# Altium project CarClimat.PrjPcb
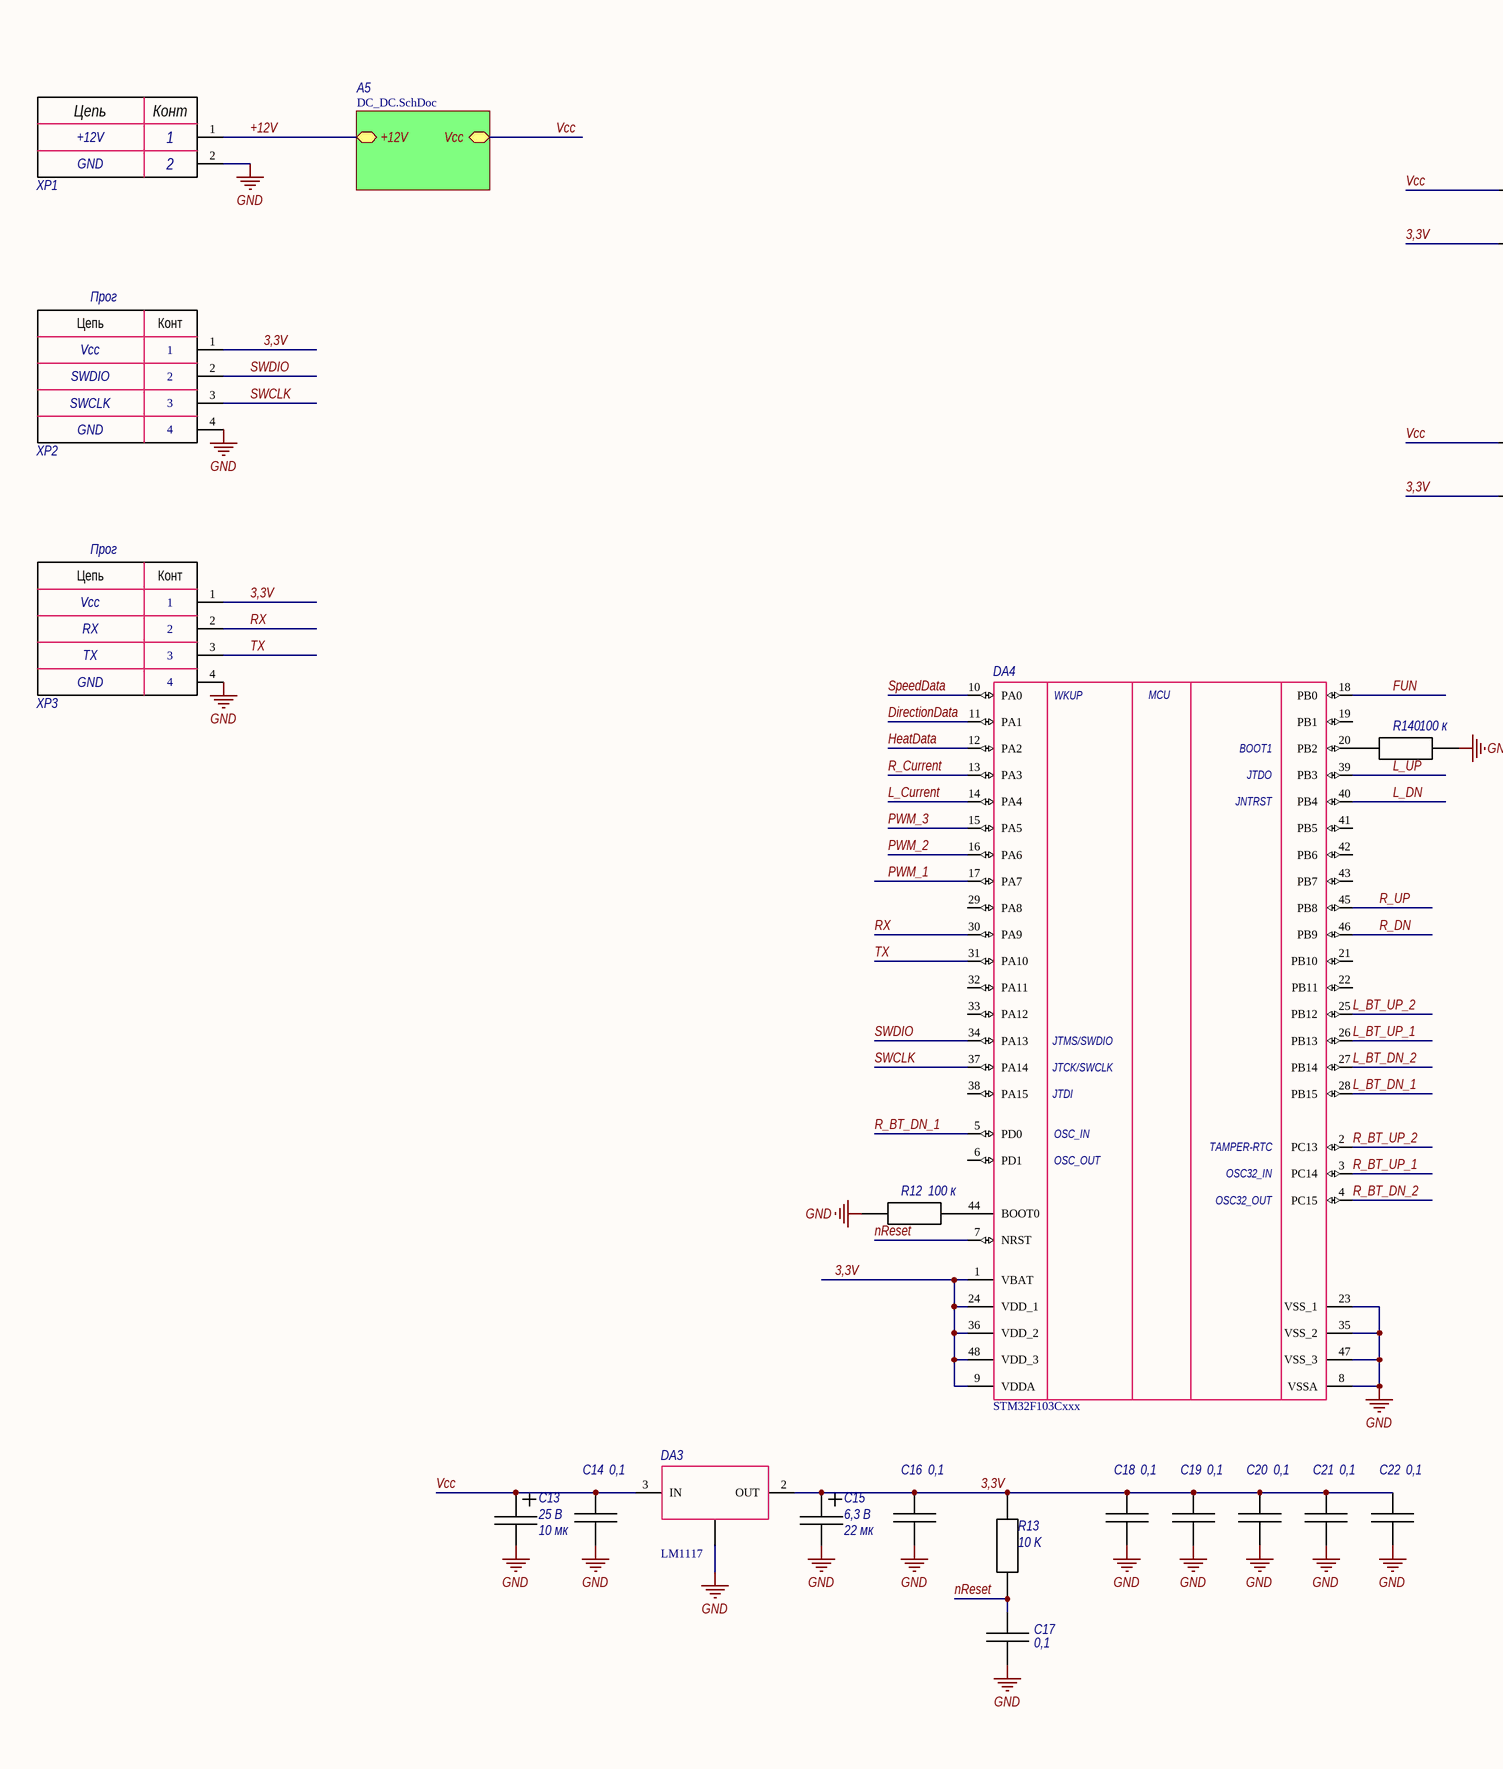
[diagram p0: MCU.SchDoc, left]
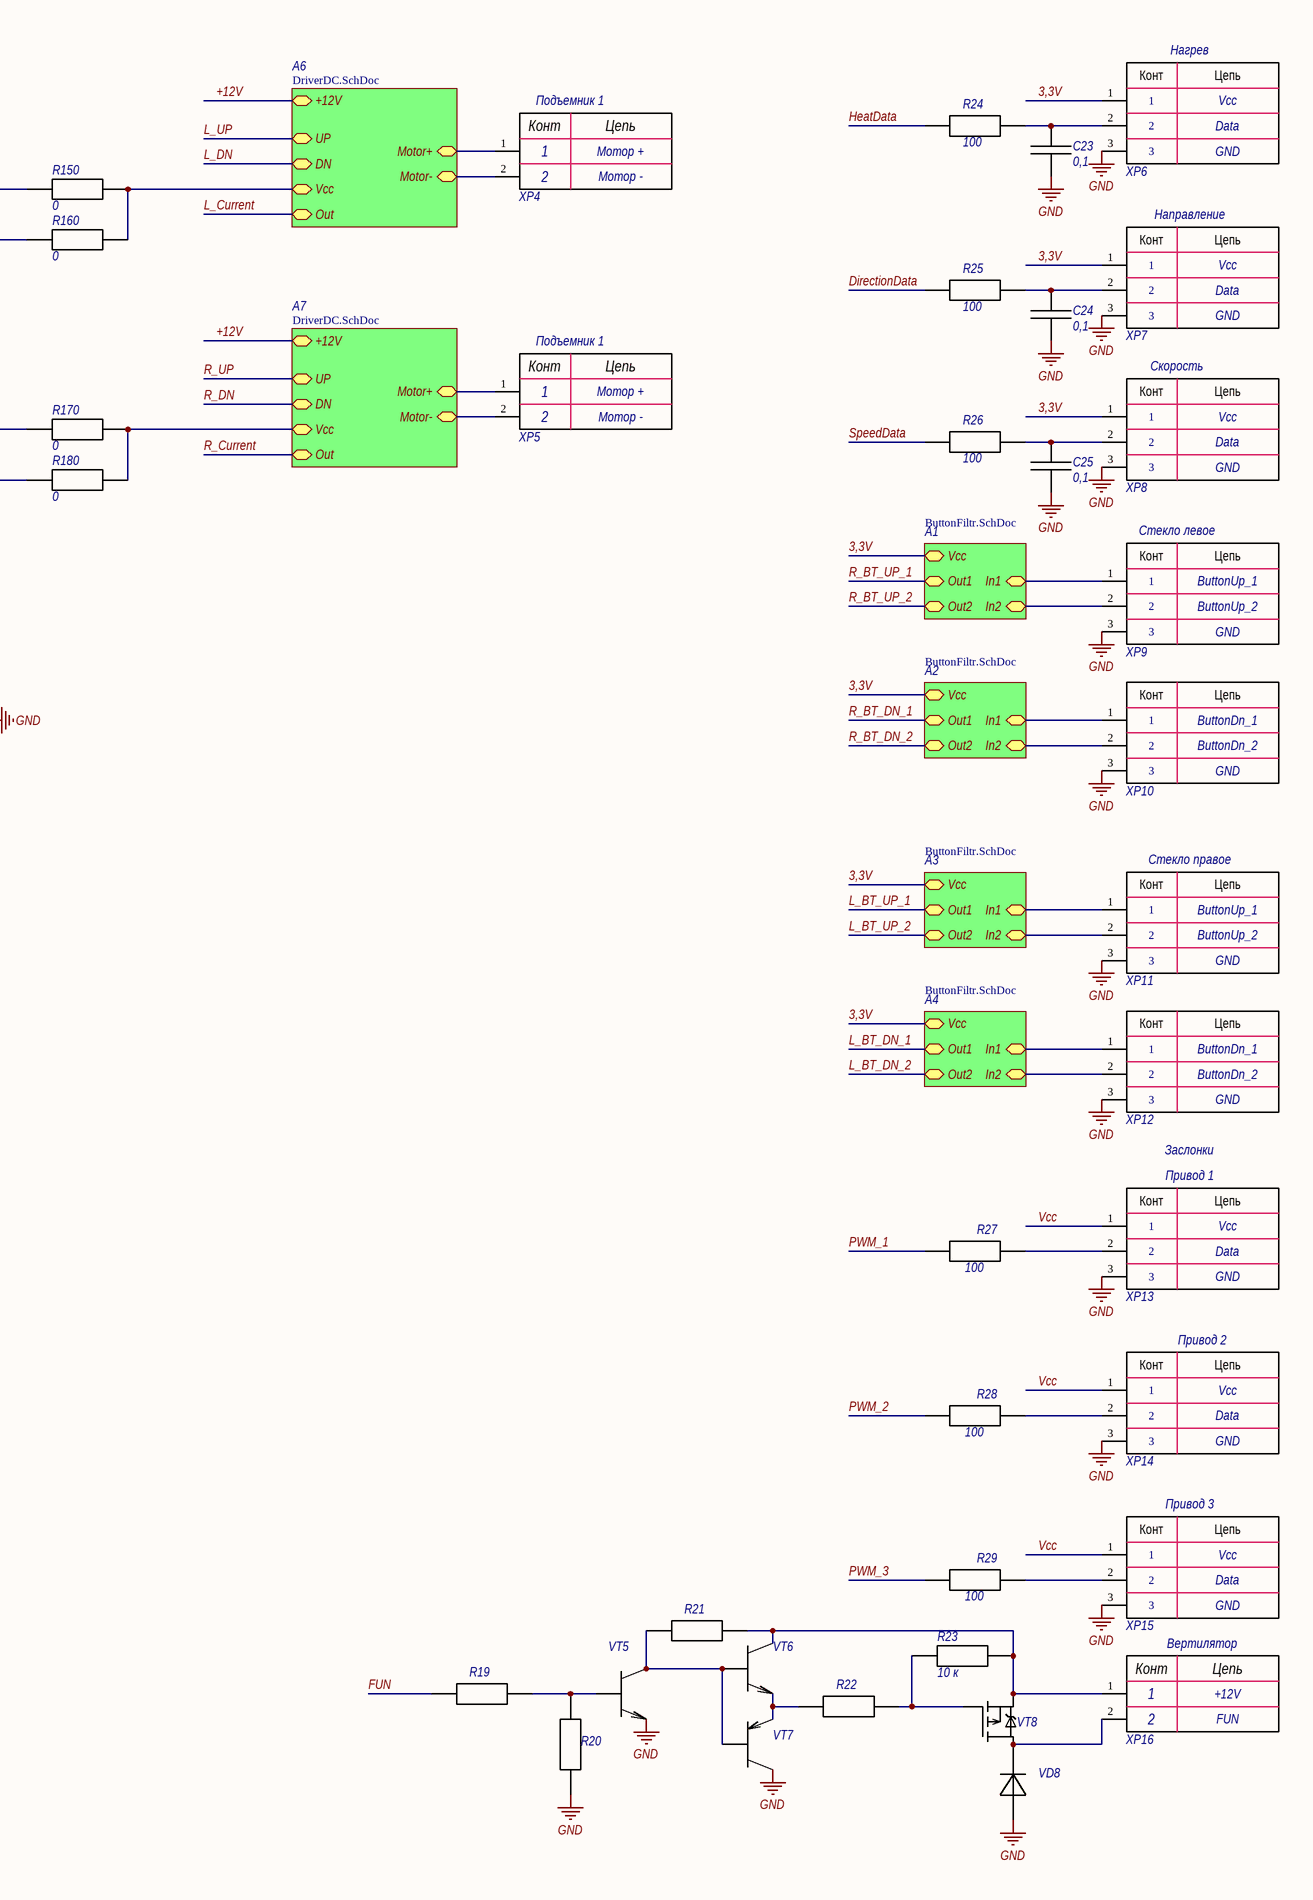
[diagram p1: MCU.SchDoc, right]
4 sheets, 127 parts. Net scope: hierarchical (ports join the sheet entries above them; power ports are global).
Board file: CarClimat.PcbDoc
Sheets:
  MCU.SchDoc
    A1 = ButtonFiltr.SchDoc
    A2 = ButtonFiltr.SchDoc
    A3 = ButtonFiltr.SchDoc
    A4 = ButtonFiltr.SchDoc
    A5 = DC_DC.SchDoc
    A6 = DriverDC.SchDoc
    A7 = DriverDC.SchDoc

## Sheet MCU.SchDoc
size A2

### Parts
C13  Power/Voltage: 25 В  Value Sch: 10 мк  [B-B]  (hidden comment: Конденсаторы танталовые)
C14  Value Sch: 0,1  [C0603_autoMount]  (hidden comment: Конденсаторы керамические)
C15  Power/Voltage: 6,3 В  Value Sch: 22 мк  [A-A]  (hidden comment: Конденсаторы танталовые)
C16  Value Sch: 0,1  [C0603_autoMount]  (hidden comment: Конденсаторы керамические)
C17  Value Sch: 0,1  [C0603_autoMount]  (hidden comment: Конденсаторы керамические)
C18  Value Sch: 0,1  [C0603_autoMount]  (hidden comment: Конденсаторы керамические)
C19  Value Sch: 0,1  [C0603_autoMount]  (hidden comment: Конденсаторы керамические)
C20  Value Sch: 0,1  [C0603_autoMount]  (hidden comment: Конденсаторы керамические)
C21  Value Sch: 0,1  [C0603_autoMount]  (hidden comment: Конденсаторы керамические)
C22  Value Sch: 0,1  [C0603_autoMount]  (hidden comment: Конденсаторы керамические)
C23  Value Sch: 0,1  [C0603_autoMount]  (hidden comment: Конденсаторы керамические)
C24  Value Sch: 0,1  [C0603_autoMount]  (hidden comment: Конденсаторы керамические)
C25  Value Sch: 0,1  [C0603_autoMount]  (hidden comment: Конденсаторы керамические)
DA3  LM1117  [SOT223]
DA4  STM32F103Cxxx  [TQFP_48]
R12  Value Sсh: 100 к  [R0603_autoMount]  (hidden comment: Resistor)
R13  Value Euro: 10 K  [R0603_autoMount]  (hidden comment: Resistor)
R19  Resistor  [R0603_autoMount]  (value not drawn)
R20  Resistor  [R0603_autoMount]  (value not drawn)
R21  Resistor  [R0603_autoMount]  (value not drawn)
R22  Resistor  [R0603_autoMount]  (value not drawn)
R23  Value Sсh: 10 к  [R0603_autoMount]  (hidden comment: Resistor)
R24  Value Sсh: 100  [R0603_autoMount]  (hidden comment: Resistor)
R25  Value Sсh: 100  [R0603_autoMount]  (hidden comment: Resistor)
R26  Value Sсh: 100  [R0603_autoMount]  (hidden comment: Resistor)
R27  Value Sсh: 100  [R0603_autoMount]  (hidden comment: Resistor)
R28  Value Sсh: 100  [R0603_autoMount]  (hidden comment: Resistor)
R29  Value Sсh: 100  [R0603_autoMount]  (hidden comment: Resistor)
R140  Value Sсh: 100 к  [R0603_autoMount]  (hidden comment: Resistor)
R150  Value Sсh: 0  [R0603_autoMount]  (hidden comment: Resistor)
R160  Value Sсh: 0  [R0603_autoMount]  (hidden comment: Resistor)
R170  Value Sсh: 0  [R0603_autoMount]  (hidden comment: Resistor)
R180  Value Sсh: 0  [R0603_autoMount]  (hidden comment: Resistor)
VD8  Diode  [DO-41_Vertical]  (value not drawn)
VT5  npn  [SOT23-3]  (value not drawn)
VT6  npn  [SOT23-3]  (value not drawn)
VT7  pnp  [SOT23-3]  (value not drawn)
VT8  P-Chanel Mosfet_dpak  [DPAK]  (value not drawn)
XP1  2pin  [301-021-12]  (value not drawn)
XP2  4pin  [PLS-4]  (value not drawn)
XP3  4pin  [PLS-4]  (value not drawn)
XP4  2pin  [301-021-12]  (value not drawn)
XP5  2pin  [301-021-12]  (value not drawn)
XP6  3pin  [CWF-3]  (value not drawn)
XP7  3pin  [CWF-3]  (value not drawn)
XP8  3pin  [CWF-3]  (value not drawn)
XP9  3pin  [CWF-3]  (value not drawn)
XP10  3pin  [CWF-3]  (value not drawn)
XP11  3pin  [CWF-3]  (value not drawn)
XP12  3pin  [CWF-3]  (value not drawn)
XP13  3pin  [CWF-3]  (value not drawn)
XP14  3pin  [CWF-3]  (value not drawn)
XP15  3pin  [CWF-3]  (value not drawn)
XP16  2pin  [301-021-12]  (value not drawn)

### Sub-sheets
A1 = ButtonFiltr.SchDoc: In2, Out2, Out1, In1, Vcc
A2 = ButtonFiltr.SchDoc: In2, Out2, Out1, In1, Vcc
A3 = ButtonFiltr.SchDoc: In2, Out2, Out1, In1, Vcc
A4 = ButtonFiltr.SchDoc: In2, Out2, Out1, In1, Vcc
A5 = DC_DC.SchDoc: Vcc, +12V
A6 = DriverDC.SchDoc: +12V, UP, DN, Motor+, Motor-, Vcc, Out
A7 = DriverDC.SchDoc: +12V, UP, DN, Motor+, Motor-, Vcc, Out

### Nets
GND: C13.2 C14.1 C15.2 C16.1 C17.1 C18.1 C19.1 C20.1 C21.1 C22.1 C23.1 C24.1 C25.1 DA3.1(GND) DA4.8(VSSA) DA4.23(VSS_1) DA4.35(VSS_2) DA4.47(VSS_3) R12.2 R20.2 R140.1 VD8.2 VT5.2(E) VT7.3(C) XP1.2 XP2.4 XP3.4 XP6.3 XP7.3 XP8.3 XP9.3 XP10.3 XP11.3 XP12.3 XP13.3 XP14.3 XP15.3
3,3V: C15.1 C16.2 C18.2 C19.2 C20.2 C21.2 C22.2 DA3.2(OUT) DA4.1(VBAT) DA4.9(VDDA) DA4.24(VDD_1) DA4.36(VDD_2) DA4.48(VDD_3) R13.1 R160.2 R180.2 XP2.1 XP3.1 XP6.1 XP7.1 XP8.1 ; sheet A1/Vcc, sheet A2/Vcc, sheet A3/Vcc, sheet A4/Vcc
+12V: XP1.1 ; sheet A5/+12V, sheet A6/+12V, sheet A7/+12V
DirectionData: DA4.11(PA1) R25.2
FUN: DA4.18(PB0) R19.2
HeatData: DA4.12(PA2) R24.2
L_BT_DN_1: DA4.28(PB15) ; sheet A4/Out1
L_BT_DN_2: DA4.27(PB14) ; sheet A4/Out2
L_BT_UP_1: DA4.26(PB13) ; sheet A3/Out1
L_BT_UP_2: DA4.25(PB12) ; sheet A3/Out2
L_Current: DA4.14(PA4) ; sheet A6/Out
L_DN: DA4.40(PB4) ; sheet A6/DN
L_UP: DA4.39(PB3) ; sheet A6/UP
nReset: C17.2 DA4.7(NRST) R13.2
PWM_1: DA4.17(PA7) R27.2
PWM_2: DA4.16(PA6) R28.2
PWM_3: DA4.15(PA5) R29.2
R_BT_DN_1: DA4.5(PD0) ; sheet A2/Out1
R_BT_DN_2: DA4.4(PC15) ; sheet A2/Out2
R_BT_UP_1: DA4.3(PC14) ; sheet A1/Out1
R_BT_UP_2: DA4.2(PC13) ; sheet A1/Out2
R_Current: DA4.13(PA3) ; sheet A7/Out
R_DN: DA4.46(PB9) ; sheet A7/DN
R_UP: DA4.45(PB8) ; sheet A7/UP
RX: DA4.30(PA9) XP3.2
SpeedData: DA4.10(PA0) R26.2
SWCLK: DA4.37(PA14) XP2.3
SWDIO: DA4.34(PA13) XP2.2
TX: DA4.31(PA10) XP3.3
Vcc: C13.1 C14.2 DA3.3(IN) R150.2 R170.2 XP13.1 XP14.1 XP15.1 ; sheet A5/Vcc
NetC12_A6_2: R150.1 R160.1 ; sheet A6/Vcc
NetC12_A7_2: R170.1 R180.1 ; sheet A7/Vcc
NetC23_2: C23.2 R24.1 XP6.2
NetC24_2: C24.2 R25.1 XP7.2
NetC25_2: C25.2 R26.1 XP8.2
NetDA4_20: DA4.20(PB2) R140.2
NetDA4_44: DA4.44(BOOT0) R12.1
NetR3_A1_1: XP9.1 ; sheet A1/In1
NetR3_A2_1: XP10.1 ; sheet A2/In1
NetR3_A3_1: XP11.1 ; sheet A3/In1
NetR3_A4_1: XP12.1 ; sheet A4/In1
NetR4_A1_1: XP9.2 ; sheet A1/In2
NetR4_A2_1: XP10.2 ; sheet A2/In2
NetR4_A3_1: XP11.2 ; sheet A3/In2
NetR4_A4_1: XP12.2 ; sheet A4/In2
NetR19_1: R19.1 R20.1 VT5.1(B)
NetR21_1: R21.1 R23.2 VT6.3(C) VT8.3(S) XP16.1
NetR21_2: R21.2 VT5.3(C) VT6.1(B) VT7.1(B)
NetR22_1: R22.1 R23.1 VT8.1(G)
NetR22_2: R22.2 VT6.2(E) VT7.2(E)
NetR27_1: R27.1 XP13.2
NetR28_1: R28.1 XP14.2
NetR29_1: R29.1 XP15.2
NetVD4_A6_2: XP4.1 ; sheet A6/Motor+
NetVD4_A7_2: XP5.1 ; sheet A7/Motor+
NetVD6_A6_2: XP4.2 ; sheet A6/Motor-
NetVD6_A7_2: XP5.2 ; sheet A7/Motor-
NetVD8_1: VD8.1 VT8.2(D) XP16.2

Not connected (* = marked no-connect by the designer): DA4 6(PD1) 19(PB1) 21(PB10) 22(PB11) 29(PA8) 32(PA11) 33(PA12) 38(PA15) 41(PB5) 42(PB6) 43(PB7)

### Notes on the sheet
- Нагрев
- (near XP4) Подъемник 1
- Vcc
- +12V
- GND
- Мотор +
- Мотор -
- Data
- Направление
- Прог
- SWDIO
- (near XP5) Подъемник 1
- Скорость
- SWCLK
- Стекло левое
- RX
- ButtonUp_1
- ButtonUp_2
- TX
- ButtonDn_1
- ButtonDn_2
- (near XP11) Стекло правое
- Заслонки
- Привод 1
- Привод 2
- Привод 3
- Вертилятор
- FUN
- (in symbol Вилка  CWF-3 "Connfly electronic") Конт; Цепь
- (in symbol Вилка DS1021-1*4SF11-B PLS-4 "Connfly electronic") Цепь; Конт
- (in symbol Клеммник XY301VA-5.0-2P-12 "Ningbo Xinya M&E") Конт; Цепь
- (in symbol Микросхема CH32F103C8T6 "WinChip" TQFP-48) WKUP; MCU; BOOT1; JTDO; JNTRST; JTMS/SWDIO; JTCK/SWCLK; JTDI; OSC_IN; TAMPER-RTC; OSC_OUT; OSC32_IN; OSC32_OUT

### Library data of the parts
C13 = Конденсатор танталовый 10 мкФ 25 В "B" +/- 10% T491B106K025AT "KEMET": Part Number Euro: 10 uF 25 V "B" +/- 10% T491B106K025AT "KEMET"; Voltage Euro: 25 V; Tolerance: +/- 10%; Value: 10 мкФ; Value Euro: 10 uF; Part Number: Конденсатор танталовый 10 мкФ 25 В "B" +/- 10% T491B106K025AT "KEMET"; Manufacturer: "KEMET"; ManufacturerPartNumber: T491B106K025AT; Package: "B"; ComponentType: Конденсатор танталовый
C14 C16-C25 = Чип. керам. 0603 0,1 мкФ 50 В +/-10% X7R CC0603KKX7R9BB104 "Yageo": Part Number Euro: 100 nF 50  V +/-10% X7R CC0603KKX7R9BB104 "Yageo"; Power/Voltage: 50 В; Voltage Euro: 50  V; TKE: X7R; Tolerance: +/-10%; Value: 0,1 мкФ; Value Euro: 100 nF; Part Number: Чип. керам. 0603 0,1 мкФ 50 В +/-10% X7R CC0603KKX7R9BB104 "Yageo"; Manufacturer: "Yageo"; ManufacturerPartNumber: CC0603KKX7R9BB104; Package: Чип конд. 0603; Price: 9; ComponentType: Чип. керам. 0603
C15 = Конденсатор танталовый 22 мкФ 6,3 В "A" +/- 10% TAJA226K006 "Kyocera AVX": Part Number Euro: 22 uF 6,3 V "A" +/- 10% TAJA226K006 "Kyocera AVX"; Voltage Euro: 6,3 V; Tolerance: +/- 10%; Value: 22 мкФ; Value Euro: 22 uF; Part Number: Конденсатор танталовый 22 мкФ 6,3 В "A" +/- 10% TAJA226K006 "Kyocera AVX"; Manufacturer: "Kyocera AVX"; ManufacturerPartNumber: TAJA226K006; Package: "A"; ComponentType: Конденсатор танталовый
DA3 = Стабилизатор AMS1117-3.3 "Advanced Monolithic Systems" SOT-223: Part Number: Стабилизатор AMS1117-3.3 "Advanced Monolithic Systems" SOT-223; Part Number Euro: AMS1117-3.3 "Advanced Monolithic Systems" SOT-223; Manufacturer: "Advanced Monolithic Systems"; ManufacturerPartNumber: AMS1117-3.3; Package: SOT-223; ComponentType: Стабилизатор
DA4 = Микросхема CH32F103C8T6 "WinChip" TQFP-48: Part Number: Микросхема CH32F103C8T6 "WinChip" TQFP-48; Part Number Euro: CH32F103C8T6 "WinChip" TQFP-48; Manufacturer: "WinChip"; ManufacturerPartNumber: CH32F103C8T6; Package: TQFP-48; ComponentType: Микросхема
R12 R140 = Чип рез. 0603 100 кОм  +/-1% RC0603FR-07100KL "Yageo": Part Number Euro: RC0603FR-07100KL 100 K +/-1% "Yageo"; Tolerance: +/-1%; Value: 100 кОм; Value Euro: 100 K; Part Number: Чип рез. 0603 100 кОм  +/-1% RC0603FR-07100KL "Yageo"; Manufacturer: "Yageo"; ManufacturerPartNumber: RC0603FR-07100KL; Package: Чип рез. 0603; ComponentType: Чип рез. 0603
R13 = Чип рез. 0603 10 кОм  +/-1% RC0603FR-0710KL "Yageo": Part Number Euro: RC0603FR-0710KL 10 K +/-1% "Yageo"; Tolerance: +/-1%; Value: 10 кОм; Value Sсh: 10 к; Part Number: Чип рез. 0603 10 кОм  +/-1% RC0603FR-0710KL "Yageo"; Manufacturer: "Yageo"; ManufacturerPartNumber: RC0603FR-0710KL; Package: Чип рез. 0603; ComponentType: Чип рез. 0603
R19 R21 = Чип рез. 0603 1 кОм  +/-1% RC0603FR-071KL "Yageo": Part Number Euro: RC0603FR-071KL 1 K +/-1% "Yageo"; Tolerance: +/-1%; Value: 1 кОм; Value Sсh: 1 к; Value Euro: 1 K; Part Number: Чип рез. 0603 1 кОм  +/-1% RC0603FR-071KL "Yageo"; Manufacturer: "Yageo"; ManufacturerPartNumber: RC0603FR-071KL; Package: Чип рез. 0603; ComponentType: Чип рез. 0603
R20 = Чип рез. 0603 10 кОм  +/-1% RC0603FR-0710KL "Yageo": Part Number Euro: RC0603FR-0710KL 10 K +/-1% "Yageo"; Tolerance: +/-1%; Value: 10 кОм; Value Sсh: 10 к; Value Euro: 10 K; Part Number: Чип рез. 0603 10 кОм  +/-1% RC0603FR-0710KL "Yageo"; Manufacturer: "Yageo"; ManufacturerPartNumber: RC0603FR-0710KL; Package: Чип рез. 0603; ComponentType: Чип рез. 0603
R22 = Чип рез. 0603 10 Ом  +/-1% RC0603FR-0710RL "Yageo": Part Number Euro: RC0603FR-0710RL 10 R +/-1% "Yageo"; Tolerance: +/-1%; Value: 10 Ом; Value Sсh: 10; Value Euro: 10 R; Part Number: Чип рез. 0603 10 Ом  +/-1% RC0603FR-0710RL "Yageo"; Manufacturer: "Yageo"; ManufacturerPartNumber: RC0603FR-0710RL; Package: Чип рез. 0603; ComponentType: Чип рез. 0603
R23 = Чип рез. 0603 10 кОм  +/-1% RC0603FR-0710KL "Yageo": Part Number Euro: RC0603FR-0710KL 10 K +/-1% "Yageo"; Part Number GOST: Чип рез. 0603 10 кОм  +/-1% 0,1 Вт; Tolerance: +/-1%; Value: 10 кОм; Value Euro: 10 K; Power/Voltage: 0,1 Вт; Part Number: Чип рез. 0603 10 кОм  +/-1% RC0603FR-0710KL "Yageo"; Manufacturer: "Yageo"; ManufacturerPartNumber: RC0603FR-0710KL; Package: Чип рез. 0603; ComponentType: Чип рез. 0603
R24-R29 = Чип рез. 0603 100 Ом  +/-1% RC0603FR-07100RL "Yageo": Part Number Euro: RC0603FR-07100RL 100 R +/-1% "Yageo"; Tolerance: +/-1%; Value: 100 Ом; Value Euro: 100 R; Part Number: Чип рез. 0603 100 Ом  +/-1% RC0603FR-07100RL "Yageo"; Manufacturer: "Yageo"; ManufacturerPartNumber: RC0603FR-07100RL; Package: Чип рез. 0603; ComponentType: Чип рез. 0603
R150 R160 R170 R180 = Чип рез. 0603 0 Ом  +/-1% RC0603FR-070RL "Yageo": Part Number Euro: RC0603FR-070RL 0 R +/-1% "Yageo"; Part Number GOST: Чип рез. 0603 0 Ом  +/-1% 0,1 Вт; Tolerance: +/-1%; Value: 0 Ом; Value Euro: 0 R; Power/Voltage: 0,1 Вт; Part Number: Чип рез. 0603 0 Ом  +/-1% RC0603FR-070RL "Yageo"; Manufacturer: "Yageo"; ManufacturerPartNumber: RC0603FR-070RL; Package: Чип рез. 0603; ComponentType: Чип рез. 0603
VD8 = Диод 1N4007  DO-41: ManufacturerPartNumber: 1N4007; Part Number: Диод 1N4007  DO-41; Part Number Euro: 1N4007  DO-41; Package: DO-41; ComponentType: Диод
VT5 VT6 = Транзистор BC847B SOT23-3: ManufacturerPartNumber: BC847B; Value: BC847B; Примечание: 1F; Package: SOT23-3; Part Number: Транзистор BC847B SOT23-3; Part Number Euro: BC847B SOT23-3; ComponentType: Транзистор
VT7 = Транзистор BC857B SOT23-3: ManufacturerPartNumber: BC857B; Value: BC857B; Package: SOT23-3; Part Number: Транзистор BC857B SOT23-3; Part Number Euro: BC857B SOT23-3; ComponentType: Транзистор
VT8 = Транзистор NTD2955T4G D-PAK "ON Semiconductor": Part Number: Транзистор NTD2955T4G D-PAK "ON Semiconductor"; Part Number Euro: NTD2955T4G D-PAK "ON Semiconductor"; Manufacturer: "ON Semiconductor"; ManufacturerPartNumber: NTD2955T4G; Package: D-PAK; Value: NTD2955T4G; ComponentType: Транзистор
XP1 XP4 XP5 XP16 = Клеммник XY301VA-5.0-2P-12 "Ningbo Xinya M&E": Примечание: Аналог 301-021-12; Rem: *; Value: *; Tolerance: *; Power/Voltage: *; TKE: *; ManufacturerPartNumber: XY301VA-5.0-2P-12; Manufacturer: "Ningbo Xinya M&E"; Quantity: *; Part Number: Клеммник XY301VA-5.0-2P-12 "Ningbo Xinya M&E"; Part Number Euro: XY301VA-5.0-2P-12 "Ningbo Xinya M&E"; ComponentType: Клеммник
XP2 XP3 = Вилка DS1021-1*4SF11-B PLS-4 "Connfly electronic": Rem: *; Value: *; Tolerance: *; Power/Voltage: *; TKE: *; ManufacturerPartNumber: DS1021-1*4SF11-B; Manufacturer: "Connfly electronic"; Quantity: *; Примечание: *; Package: PLS-4; Part Number: Вилка DS1021-1*4SF11-B PLS-4 "Connfly electronic"; Part Number Euro: DS1021-1*4SF11-B PLS-4 "Connfly electronic"; ComponentType: Вилка
XP6-XP15 = Вилка  CWF-3 "Connfly electronic": Rem: *; Value: *; Tolerance: *; Power/Voltage: *; TKE: *; ManufacturerPartNumber: *; Manufacturer: "Connfly electronic"; Quantity: *; Примечание: *; Package: CWF-3; Part Number: Вилка  CWF-3 "Connfly electronic"; ComponentType: Вилка

## Sheet ButtonFiltr.SchDoc
size A3
Used 4 times, as channels A1, A2, A3, A4. Parts and nets are listed once, with the designators drawn on the sheet.
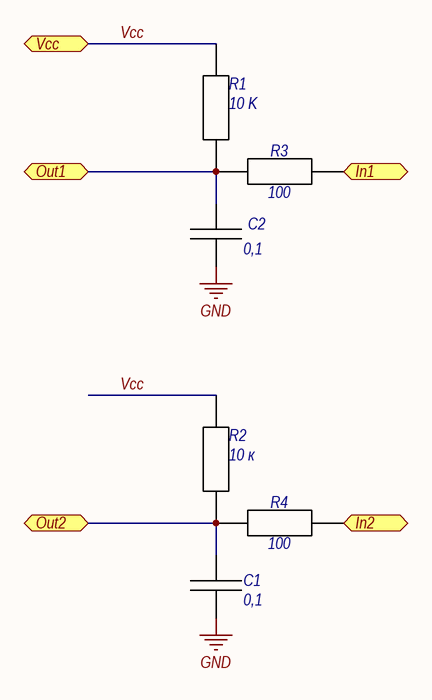
[diagram p2: ButtonFiltr.SchDoc]

### Parts
C1  Value Sch: 0,1  [C0603_autoMount]  (hidden comment: Конденсаторы керамические)
C2  Value Sch: 0,1  [C0603_autoMount]  (hidden comment: Конденсаторы керамические)
R1  Value Euro: 10 K  [R0603_autoMount]  (hidden comment: Resistor)
R2  Value Sсh: 10 к  [R0603_autoMount]  (hidden comment: Resistor)
R3  Value Sсh: 100  [R0603_autoMount]  (hidden comment: Resistor)
R4  Value Sсh: 100  [R0603_autoMount]  (hidden comment: Resistor)

### Ports
In1, In2, Out1, Out2, Vcc

### Nets
GND: C1.1 C2.1
In1: R3.1 ; port In1
In2: R4.1 ; port In2
Out1: C2.2 R1.2 R3.2 ; port Out1
Out2: C1.2 R2.2 R4.2 ; port Out2
Vcc: R1.1 R2.1 ; port Vcc

### Channels
A1: designators end in _A1; ports In1=NetR3_A1_1 In2=NetR4_A1_1 Out1=R_BT_UP_1 Out2=R_BT_UP_2 Vcc=3,3V
A2: designators end in _A2; ports In1=NetR3_A2_1 In2=NetR4_A2_1 Out1=R_BT_DN_1 Out2=R_BT_DN_2 Vcc=3,3V
A3: designators end in _A3; ports In1=NetR3_A3_1 In2=NetR4_A3_1 Out1=L_BT_UP_1 Out2=L_BT_UP_2 Vcc=3,3V
A4: designators end in _A4; ports In1=NetR3_A4_1 In2=NetR4_A4_1 Out1=L_BT_DN_1 Out2=L_BT_DN_2 Vcc=3,3V

### Library data of the parts
C1 C2 = Чип. керам. 0603 0,1 мкФ 50 В +/-10% X7R CC0603KKX7R9BB104 "Yageo": as C14 on sheet MCU; Part Number: Чип. керам. 0603 0,1 мкФ 50 В +/-10% X7R CC0603KKX7R9BB104 "Yageo"; Manufacturer: "Yageo"; ManufacturerPartNumber: CC0603KKX7R9BB104; Package: Чип конд. 0603; Price: 9; ComponentType: Чип. керам. 0603
R1 = Чип рез. 0603 10 кОм  +/-1% RC0603FR-0710KL "Yageo": as R13 on sheet MCU; Part Number: Чип рез. 0603 10 кОм  +/-1% RC0603FR-0710KL "Yageo"; Manufacturer: "Yageo"; ManufacturerPartNumber: RC0603FR-0710KL; Package: Чип рез. 0603; ComponentType: Чип рез. 0603
R2 = Чип рез. 0603 10 кОм  +/-1% RC0603FR-0710KL "Yageo": Part Number Euro: RC0603FR-0710KL 10 K +/-1% "Yageo"; Tolerance: +/-1%; Value: 10 кОм; Value Euro: 10 K; Part Number: Чип рез. 0603 10 кОм  +/-1% RC0603FR-0710KL "Yageo"; Manufacturer: "Yageo"; ManufacturerPartNumber: RC0603FR-0710KL; Package: Чип рез. 0603; ComponentType: Чип рез. 0603
R3 R4 = Чип рез. 0603 100 Ом  +/-1% RC0603FR-07100RL "Yageo": as R24 on sheet MCU; Part Number: Чип рез. 0603 100 Ом  +/-1% RC0603FR-07100RL "Yageo"; Manufacturer: "Yageo"; ManufacturerPartNumber: RC0603FR-07100RL; Package: Чип рез. 0603; ComponentType: Чип рез. 0603

## Sheet DC_DC.SchDoc
size A3
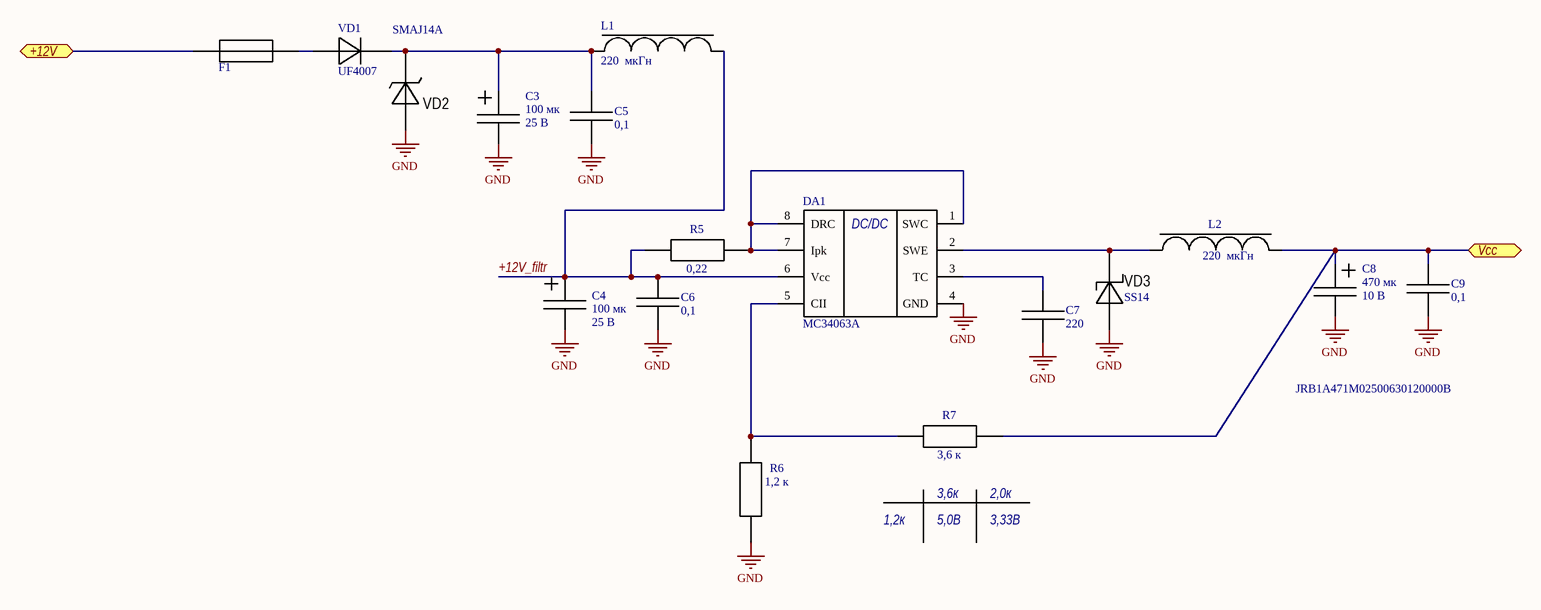
[diagram p3: DC_DC.SchDoc]

### Parts
C3  Power/Voltage: 25 В  Value Sch: 100 мк  [K50-35_6.3mm]
C4  Power/Voltage: 25 В  Value Sch: 100 мк  [K50-35_6.3mm]
C5  Value Sch: 0,1  [C0603_autoMount]  (hidden comment: Конденсаторы керамические)
C6  Value Sch: 0,1  [C0603_autoMount]  (hidden comment: Конденсаторы керамические)
C7  Value Sch: 220  [C0603_autoMount]  (hidden comment: Конденсаторы керамические)
C8  Power/Voltage: 10 В  Value Sch: 470 мк  [K50-35_8mm]  (hidden comment: Конденсаторы электролитические)
C9  Value Sch: 0,1  [C0603_autoMount]  (hidden comment: Конденсаторы керамические)
DA1  MC34063A  [SO-8]
F1  Fuse  [R1812]  (value not drawn)
L1  220  мкГн  [SDR0604]
L2  220  мкГн  [SDR0604]
R5  Value Sch: 0,22  [R1206_autoMount]  (hidden comment: Resistor)
R6  Value Sсh: 1,2 к  [R0603_autoMount]  (hidden comment: Resistor)
R7  Value Sсh: 3,6 к  [R0603_autoMount]  (hidden comment: Resistor)
VD1  ManufacturerPartNumber: UF4007  [DO-41_H_10mm]  (hidden comment: Diode)
VD2  TVS  [DO-214AC SMA]  (value not drawn)
VD3  ManufacturerPartNumber: SS14  [DO-214AC_SMA]  (hidden comment: Shottke)

### Ports
+12V, Vcc

### Nets
GND: C3.2 C4.2 C5.1 C6.1 C7.1 C8.2 C9.1 DA1.4(GND) R6.2 VD2.2 VD3.2
+12V: F1.2 ; port +12V
+12V_filtr: C4.1 C6.2 DA1.6(Vcc) L1.1 R5.2
Vcc: C8.1 C9.2 L2.1 R7.2 ; port Vcc
NetC3_1: C3.1 C5.2 L1.2 VD1.1 VD2.1
NetC7_2: C7.2 DA1.3(TC)
NetDA1_1: DA1.1(SWC) DA1.7(Ipk) DA1.8(DRC) R5.1
NetDA1_2: DA1.2(SWE) L2.2 VD3.1
NetDA1_5: DA1.5(CII) R6.1 R7.1
NetF1_1: F1.1 VD1.2

### Notes on the sheet
- SMAJ14A
- JRB1A471M02500630120000B
- (near R7) 3,6к
- (near R7) 2,0к
- 1,2к
- 5,0В
- 3,33В
- (in symbol Микросхема MC34063EC "ST Microelectronix" SO-8) DC/DC

### Library data of the parts
C3 C4 = Конденсатор электролит. K50-35 100 мкФ 25 В +/- 20% JRB1E101M02500630110000B "JB": Part Number Euro: K50-35 100 uF 25 V +/- 20% JRB1E101M02500630110000B "JB"; Manufacturer: "JB"; Voltage Euro: 25 V; Tolerance: +/- 20%; Value: 100 мкФ; Value Euro: 100 uF; Part Number: Конденсатор электролит. K50-35 100 мкФ 25 В +/- 20% JRB1E101M02500630110000B "JB"; ManufacturerPartNumber: JRB1E101M02500630110000B; Package: K50-35; ComponentType: Конденсатор электролит.
C5 C6 C9 = Чип. керам. 0603 0,1 мкФ 50 В +/-10% X7R CC0603KKX7R9BB104 "Yageo": as C14 on sheet MCU; Part Number: Чип. керам. 0603 0,1 мкФ 50 В +/-10% X7R CC0603KKX7R9BB104 "Yageo"; Manufacturer: "Yageo"; ManufacturerPartNumber: CC0603KKX7R9BB104; Package: Чип конд. 0603; Price: 9; ComponentType: Чип. керам. 0603
C7 = Чип. керам. 0603 220 пФ 50 В +/-5% NP0 GRM1885C1H221J "Murata": Part Number Euro: 220 50 V +/-5% NP0 GRM1885C1H221J "Murata"; Power/Voltage: 50 В; Voltage Euro: 50 V; TKE: NP0; Tolerance: +/-5%; Value: 220 пФ; Part Number: Чип. керам. 0603 220 пФ 50 В +/-5% NP0 GRM1885C1H221J "Murata"; Manufacturer: "Murata"; ManufacturerPartNumber: GRM1885C1H221J; Package: Чип конд. 0603; Value Euro: 220; ComponentType: Чип. керам. 0603
C8 = Конденсатор электролит. К50-35 470 мкФ 10 В +/- 20% JRK1A471M03500800070000B: Part Number Euro: К50-35 470 uF 10 V +/- 20% JRK1A471M03500800070000B; Voltage Euro: 10 V; Tolerance: +/- 20%; Value: 470 мкФ; Value Euro: 470 uF; Part Number: Конденсатор электролит. К50-35 470 мкФ 10 В +/- 20% JRK1A471M03500800070000B; ManufacturerPartNumber: JRK1A471M03500800070000B; Package: К50-35; ComponentType: Конденсатор электролит.
DA1 = Микросхема MC34063EC "ST Microelectronix" SO-8: Manufacturer: "ST Microelectronix"; ManufacturerPartNumber: MC34063EC; Package: SO-8; Part Number: Микросхема MC34063EC "ST Microelectronix" SO-8; Part Number Euro: MC34063EC "ST Microelectronix" SO-8; ComponentType: Микросхема
F1 = Предохранитель   0,2 A, 30 В 1812L020PR "Littelfuse": Part Number: Предохранитель   0,2 A, 30 В 1812L020PR "Littelfuse"; Part Number Euro: 0,2 A, 30 В 1812L020PR "Littelfuse"; Manufacturer: "Littelfuse"; ManufacturerPartNumber: 1812L020PR; Power/Voltage: 0,2 A, 30 В; ComponentType: Предохранитель
L1 L2 = Дроссель 220  мкГн +/-20% SDR0604-221KL "Bourns": Part Number Euro: 220  uH +/-20% SDR0604-221KL "Bourns"; Tolerance: +/-20%; Value Euro: 220  uH; Manufacturer: "Bourns"; ManufacturerPartNumber: SDR0604-221KL; Value: 220  мкГн; Part Number: Дроссель 220  мкГн +/-20% SDR0604-221KL "Bourns"; Value Sch: 220  мкГн; ComponentType: Дроссель
R5 = Чип рез. 1206 0,22 Ом  +/-1% RC1206FR-070R22L "Yageo": Part Number Euro: RC1206FR-070R22L 0,22 Ом +/-1% "Yageo"; Tolerance: +/-1%; Value: 0,22 Ом; Part Number: Чип рез. 1206 0,22 Ом  +/-1% RC1206FR-070R22L "Yageo"; Manufacturer: "Yageo"; ManufacturerPartNumber: RC1206FR-070R22L; Package: Чип рез. 1206; Value Euro: 0,22 Ом; ComponentType: Чип рез. 1206
R6 = Чип рез. 0603 1,2 кОм  +/-1% RC0603FR-071K2L "Yageo": Part Number Euro: RC0603FR-071K2L 1,2 K +/-1% "Yageo"; Tolerance: +/-1%; Value: 1,2 кОм; Value Euro: 1,2 K; Part Number: Чип рез. 0603 1,2 кОм  +/-1% RC0603FR-071K2L "Yageo"; Manufacturer: "Yageo"; ManufacturerPartNumber: RC0603FR-071K2L; Package: Чип рез. 0603; ComponentType: Чип рез. 0603
R7 = Чип рез. 0603 3,6 кОм  +/-1% RC0603FR-073K6L "Yageo": Part Number Euro: RC0603FR-073K6L 3,6 K +/-1% "Yageo"; Tolerance: +/-1%; Value: 3,6 кОм; Value Euro: 3,6 K; Part Number: Чип рез. 0603 3,6 кОм  +/-1% RC0603FR-073K6L "Yageo"; Manufacturer: "Yageo"; ManufacturerPartNumber: RC0603FR-073K6L; Package: Чип рез. 0603; ComponentType: Чип рез. 0603
VD1 = Диод UF4007 "ST Microelectronics" DO-41: Part Number: Диод UF4007 "ST Microelectronics" DO-41; Part Number Euro: UF4007 "ST Microelectronics" DO-41; Manufacturer: "ST Microelectronics"; Package: DO-41; ComponentType: Диод
VD2 = Диод SMAJ14A "Littelfuse" SMA/DO-214AC: Part Number: Диод SMAJ14A "Littelfuse" SMA/DO-214AC; Part Number Euro: SMAJ14A "Littelfuse" SMA/DO-214AC; Manufacturer: "Littelfuse"; ManufacturerPartNumber: SMAJ14A; Package: SMA/DO-214AC; ComponentType: Диод
VD3 = Диод SS14 "ON Semiconductor" SMA/DO-214AC: Part Number: Диод SS14 "ON Semiconductor" SMA/DO-214AC; Part Number Euro: SS14 "ON Semiconductor" SMA/DO-214AC; Manufacturer: "ON Semiconductor"; Package: SMA/DO-214AC; ComponentType: Диод

## Sheet DriverDC.SchDoc
size A3
Used 2 times, as channels A6, A7. Parts and nets are listed once, with the designators drawn on the sheet.
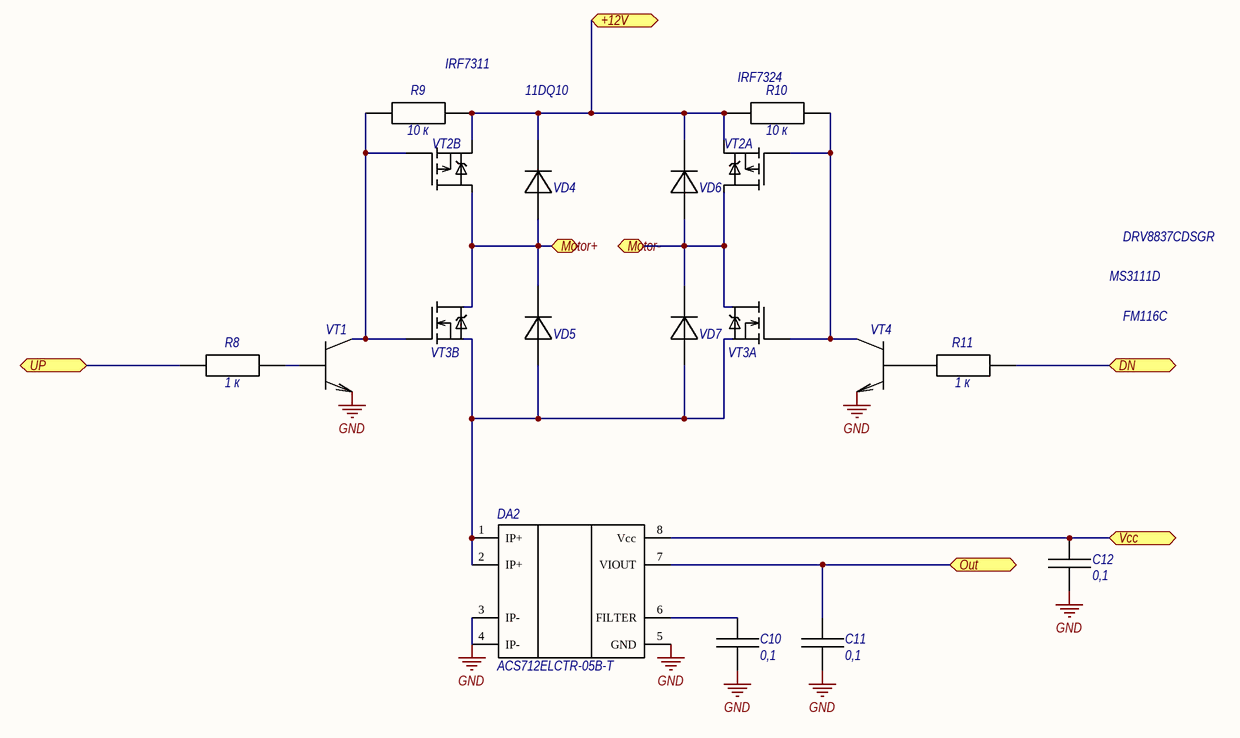
[diagram p4: DriverDC.SchDoc]

### Parts
C10  Value Sch: 0,1  [C0603_autoMount]  (hidden comment: Конденсаторы керамические)
C11  Value Sch: 0,1  [C0603_autoMount]  (hidden comment: Конденсаторы керамические)
C12  Value Sch: 0,1  [C0603_autoMount]  (hidden comment: Конденсаторы керамические)
DA2  ManufacturerPartNumber: ACS712ELCTR-05B-T  [SOIC-8]  (hidden comment: ASC712)
R8  Value Sсh: 1 к  [R0603_autoMount]  (hidden comment: Resistor)
R9  Value Sсh: 10 к  [R0603_autoMount]  (hidden comment: Resistor)
R10  Value Sсh: 10 к  [R0603_autoMount]  (hidden comment: Resistor)
R11  Value Sсh: 1 к  [R0603_autoMount]  (hidden comment: Resistor)
VD4  Diode  [DO-41_H_10mm]  (value not drawn)
VD5  Diode  [DO-41_H_10mm]  (value not drawn)
VD6  Diode  [DO-41_H_10mm]  (value not drawn)
VD7  Diode  [DO-41_H_10mm]  (value not drawn)
VT1  npn  [SOT23-3]  (value not drawn)
VT2  2P-Chanel Mosfet_SO_8  [SO-8]  (value not drawn)  (parts A,B of 2)
VT3  2N-Chanel Mosfet_SO_8  [SO-8]  (value not drawn)  (parts A,B of 2)
VT4  npn  [SOT23-3]  (value not drawn)

### Ports
+12V, DN, Motor+, Motor-, Out, UP, Vcc

### Nets
GND: C10.1 C11.1 C12.1 DA2.3(IP-) DA2.4(IP-) DA2.5(GND) VT1.2(E) VT4.2(E)
+12V: R9.1 R10.2 VD4.1 VD6.1 VT2.1(S2) VT2.3(S1) ; port +12V
DN: R11.1 ; port DN
Motor+: VD4.2 VD5.1 VT2.7,8(D2) VT3.5,6(D2) ; port Motor+
Motor-: VD6.2 VD7.1 VT2.5,6(D1) VT3.7,8(D1) ; port Motor-
Out: C11.2 DA2.7(VIOUT) ; port Out
UP: R8.2 ; port UP
Vcc: C12.2 DA2.8(Vcc) ; port Vcc
NetC10_2: C10.2 DA2.6(FILTER)
NetDA2_1: DA2.1(IP+) DA2.2(IP+) VD5.2 VD7.2 VT3.1(S1) VT3.3(S2)
NetR8_1: R8.1 VT1.1(B)
NetR9_2: R9.2 VT1.3(C) VT2.2(G2) VT3.4(G2)
NetR10_1: R10.1 VT2.4(G1) VT3.2(G1) VT4.3(C)
NetR11_2: R11.2 VT4.1(B)

### Channels
A6: designators end in _A6; ports +12V=+12V DN=L_DN Motor+=NetVD4_A6_2 Motor-=NetVD6_A6_2 Out=L_Current UP=L_UP Vcc=NetC12_A6_2
A7: designators end in _A7; ports +12V=+12V DN=R_DN Motor+=NetVD4_A7_2 Motor-=NetVD6_A7_2 Out=R_Current UP=R_UP Vcc=NetC12_A7_2

### Notes on the sheet
- (near R9) IRF7311
- 11DQ10
- (near R10) IRF7324
- DRV8837CDSGR
- MS3111D
- FM116C

### Library data of the parts
C10-C12 = Чип. керам. 0603 0,1 мкФ 50 В +/-10% X7R CC0603KKX7R9BB104 "Yageo": as C14 on sheet MCU; Part Number: Чип. керам. 0603 0,1 мкФ 50 В +/-10% X7R CC0603KKX7R9BB104 "Yageo"; Manufacturer: "Yageo"; ManufacturerPartNumber: CC0603KKX7R9BB104; Package: Чип конд. 0603; Price: 9; ComponentType: Чип. керам. 0603
DA2 = Микросхема ACS712ELCTR-05B-T "Allegro" SOIC-8: Part Number: Микросхема ACS712ELCTR-05B-T "Allegro" SOIC-8; Part Number Euro: ACS712ELCTR-05B-T "Allegro" SOIC-8; Manufacturer: "Allegro"; Package: SOIC-8; ComponentType: Микросхема
R8 R11 = Чип рез. 0603 1 кОм  +/-1% RC0603FR-071KL "Yageo": Part Number Euro: RC0603FR-071KL 1 K +/-1% "Yageo"; Tolerance: +/-1%; Value: 1 кОм; Value Euro: 1 K; Part Number: Чип рез. 0603 1 кОм  +/-1% RC0603FR-071KL "Yageo"; Manufacturer: "Yageo"; ManufacturerPartNumber: RC0603FR-071KL; Package: Чип рез. 0603; ComponentType: Чип рез. 0603
R9 R10 = Чип рез. 0603 10 кОм  +/-1% RC0603FR-0710KL "Yageo": as R2 on sheet ButtonFiltr; Part Number: Чип рез. 0603 10 кОм  +/-1% RC0603FR-0710KL "Yageo"; Manufacturer: "Yageo"; ManufacturerPartNumber: RC0603FR-0710KL; Package: Чип рез. 0603; ComponentType: Чип рез. 0603
VD4-VD7 = Диод UF4007 "ST Microelectronics" DO-41: ManufacturerPartNumber: UF4007; Part Number: Диод UF4007 "ST Microelectronics" DO-41; Part Number Euro: UF4007 "ST Microelectronics" DO-41; Manufacturer: "ST Microelectronics"; Package: DO-41; ComponentType: Диод
VT1 VT4 = Транзистор BC847B SOT23-3: as VT5 on sheet MCU; Package: SOT23-3; Part Number: Транзистор BC847B SOT23-3; Part Number Euro: BC847B SOT23-3; ComponentType: Транзистор
VT2 = Транзистор IRF9358TRPBF SO-8 "Inferon": Part Number: Транзистор IRF9358TRPBF SO-8 "Inferon"; Part Number Euro: IRF9358TRPBF SO-8 "Inferon"; Manufacturer: "Inferon"; ManufacturerPartNumber: IRF9358TRPBF; Package: SO-8; ComponentType: Транзистор
VT3 = Транзистор AO4828 SO-8 "UMV": Manufacturer: "UMV"; ManufacturerPartNumber: AO4828; Value: AO4828; Part Number: Транзистор AO4828 SO-8 "UMV"; Part Number Euro: AO4828 SO-8 "UMV"; Package: SO-8; ComponentType: Транзистор

## Nets that join several sheets
GND: MCU (37 pins), A1 (C1_A1.1 C2_A1.1), A2 (C1_A2.1 C2_A2.1), A3 (C1_A3.1 C2_A3.1), A4 (C1_A4.1 C2_A4.1), DC_DC (11 pins), A6 (8 pins), A7 (8 pins)
3,3V: MCU (21 pins), A1 (R1_A1.1 R2_A1.1), A2 (R1_A2.1 R2_A2.1), A3 (R1_A3.1 R2_A3.1), A4 (R1_A4.1 R2_A4.1)
+12V: MCU (XP1.1), DC_DC (F1.2), A6 (6 pins), A7 (6 pins)
L_BT_DN_1: MCU (DA4.28), A4 (C2_A4.2 R1_A4.2 R3_A4.2)
L_BT_DN_2: MCU (DA4.27), A4 (C1_A4.2 R2_A4.2 R4_A4.2)
L_BT_UP_1: MCU (DA4.26), A3 (C2_A3.2 R1_A3.2 R3_A3.2)
L_BT_UP_2: MCU (DA4.25), A3 (C1_A3.2 R2_A3.2 R4_A3.2)
L_Current: MCU (DA4.14), A6 (C11_A6.2 DA2_A6.7)
L_DN: MCU (DA4.40), A6 (R11_A6.1)
L_UP: MCU (DA4.39), A6 (R8_A6.2)
NetC12_A6_2: MCU (R150.1 R160.1), A6 (C12_A6.2 DA2_A6.8)
NetC12_A7_2: MCU (R170.1 R180.1), A7 (C12_A7.2 DA2_A7.8)
NetR3_A1_1: MCU (XP9.1), A1 (R3_A1.1)
NetR3_A2_1: MCU (XP10.1), A2 (R3_A2.1)
NetR3_A3_1: MCU (XP11.1), A3 (R3_A3.1)
NetR3_A4_1: MCU (XP12.1), A4 (R3_A4.1)
NetR4_A1_1: MCU (XP9.2), A1 (R4_A1.1)
NetR4_A2_1: MCU (XP10.2), A2 (R4_A2.1)
NetR4_A3_1: MCU (XP11.2), A3 (R4_A3.1)
NetR4_A4_1: MCU (XP12.2), A4 (R4_A4.1)
NetVD4_A6_2: MCU (XP4.1), A6 (VD4_A6.2 VD5_A6.1 VT2_A6.7,8 VT3_A6.5,6)
NetVD4_A7_2: MCU (XP5.1), A7 (VD4_A7.2 VD5_A7.1 VT2_A7.7,8 VT3_A7.5,6)
NetVD6_A6_2: MCU (XP4.2), A6 (VD6_A6.2 VD7_A6.1 VT2_A6.5,6 VT3_A6.7,8)
NetVD6_A7_2: MCU (XP5.2), A7 (VD6_A7.2 VD7_A7.1 VT2_A7.5,6 VT3_A7.7,8)
R_BT_DN_1: MCU (DA4.5), A2 (C2_A2.2 R1_A2.2 R3_A2.2)
R_BT_DN_2: MCU (DA4.4), A2 (C1_A2.2 R2_A2.2 R4_A2.2)
R_BT_UP_1: MCU (DA4.3), A1 (C2_A1.2 R1_A1.2 R3_A1.2)
R_BT_UP_2: MCU (DA4.2), A1 (C1_A1.2 R2_A1.2 R4_A1.2)
R_Current: MCU (DA4.13), A7 (C11_A7.2 DA2_A7.7)
R_DN: MCU (DA4.46), A7 (R11_A7.1)
R_UP: MCU (DA4.45), A7 (R8_A7.2)
Vcc: MCU (8 pins), DC_DC (C8.1 C9.2 L2.1 R7.2)